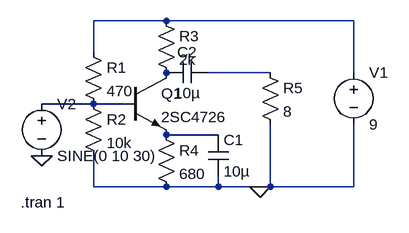
[diagram p0: schematic weirdnonworkingamp.asc]
weirdnonworkingamp.asc, the LTspice schematic file:
Version 4
SHEET 1 880 680
WIRE 224 -16 112 -16
WIRE 512 -16 224 -16
WIRE 112 32 112 -16
WIRE 384 64 288 64
WIRE 512 64 512 -16
WIRE 112 112 32 112
WIRE 160 112 112 112
WIRE 304 160 224 160
WIRE 112 240 112 192
WIRE 224 240 112 240
WIRE 304 240 304 224
WIRE 304 240 224 240
WIRE 368 240 304 240
WIRE 384 240 384 144
WIRE 384 240 368 240
WIRE 512 240 512 144
WIRE 512 240 384 240
FLAG 368 240 0
FLAG 32 192 0
SYMBOL res 96 16 R0
SYMATTR InstName R1
SYMATTR Value 470
SYMBOL res 96 96 R0
SYMATTR InstName R2
SYMATTR Value 10k
SYMBOL res 208 -32 R0
SYMATTR InstName R3
SYMATTR Value 2k
SYMBOL npn 160 64 R0
SYMATTR InstName Q1
SYMATTR Value 2SC4726
SYMBOL res 208 144 R0
SYMATTR InstName R4
SYMATTR Value 680
SYMBOL cap 288 160 R0
SYMATTR InstName C1
SYMATTR Value 10µ
SYMATTR SpiceLine V=2.5 Irms=0 Rser=0 Lser=0 mfg="Murata" pn="GRM155R60E106ME16" type="X5R"
SYMBOL cap 288 48 R90
WINDOW 0 0 32 VBottom 2
WINDOW 3 32 32 VTop 2
SYMATTR InstName C2
SYMATTR Value 10µ
SYMBOL voltage 512 48 R0
WINDOW 123 0 0 Left 0
WINDOW 39 0 0 Left 0
SYMATTR InstName V1
SYMATTR Value 9
SYMBOL voltage 32 96 R0
WINDOW 123 0 0 Left 0
WINDOW 39 0 0 Left 0
SYMATTR InstName V2
SYMATTR Value SINE(0 10 30)
SYMBOL res 368 48 R0
SYMATTR InstName R5
SYMATTR Value 8
TEXT 0 264 Left 2 !.tran 1

The netlist it stands for:
* weirdnonworkingamp.asc
R1 N001 N003 470
R2 N003 0 10k
R3 N001 P001 2k
Q1 P001 N003 N004 0 2SC4726
R4 N004 0 680
C1 N004 0 10µ V=2.5 Irms=0 Rser=0 Lser=0 mfg="Murata" pn="GRM155R60E106ME16" type="X5R"
C2 N002 P001 10µ
V1 N001 0 9
V2 N003 0 SINE(0 10 30)
R5 N002 0 8
.model NPN NPN
.model PNP PNP
.lib standard.bjt
.tran 1
.backanno
.end